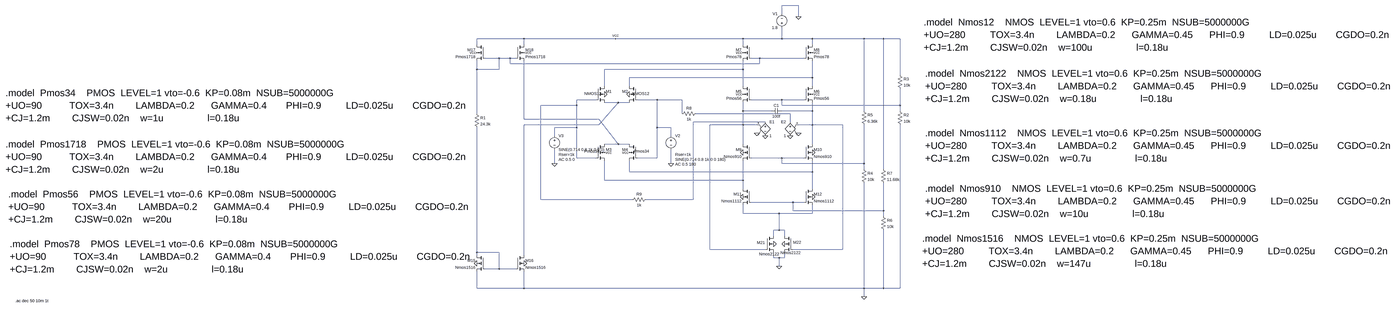
[diagram p0: schematic Project.asc, whole sheet]
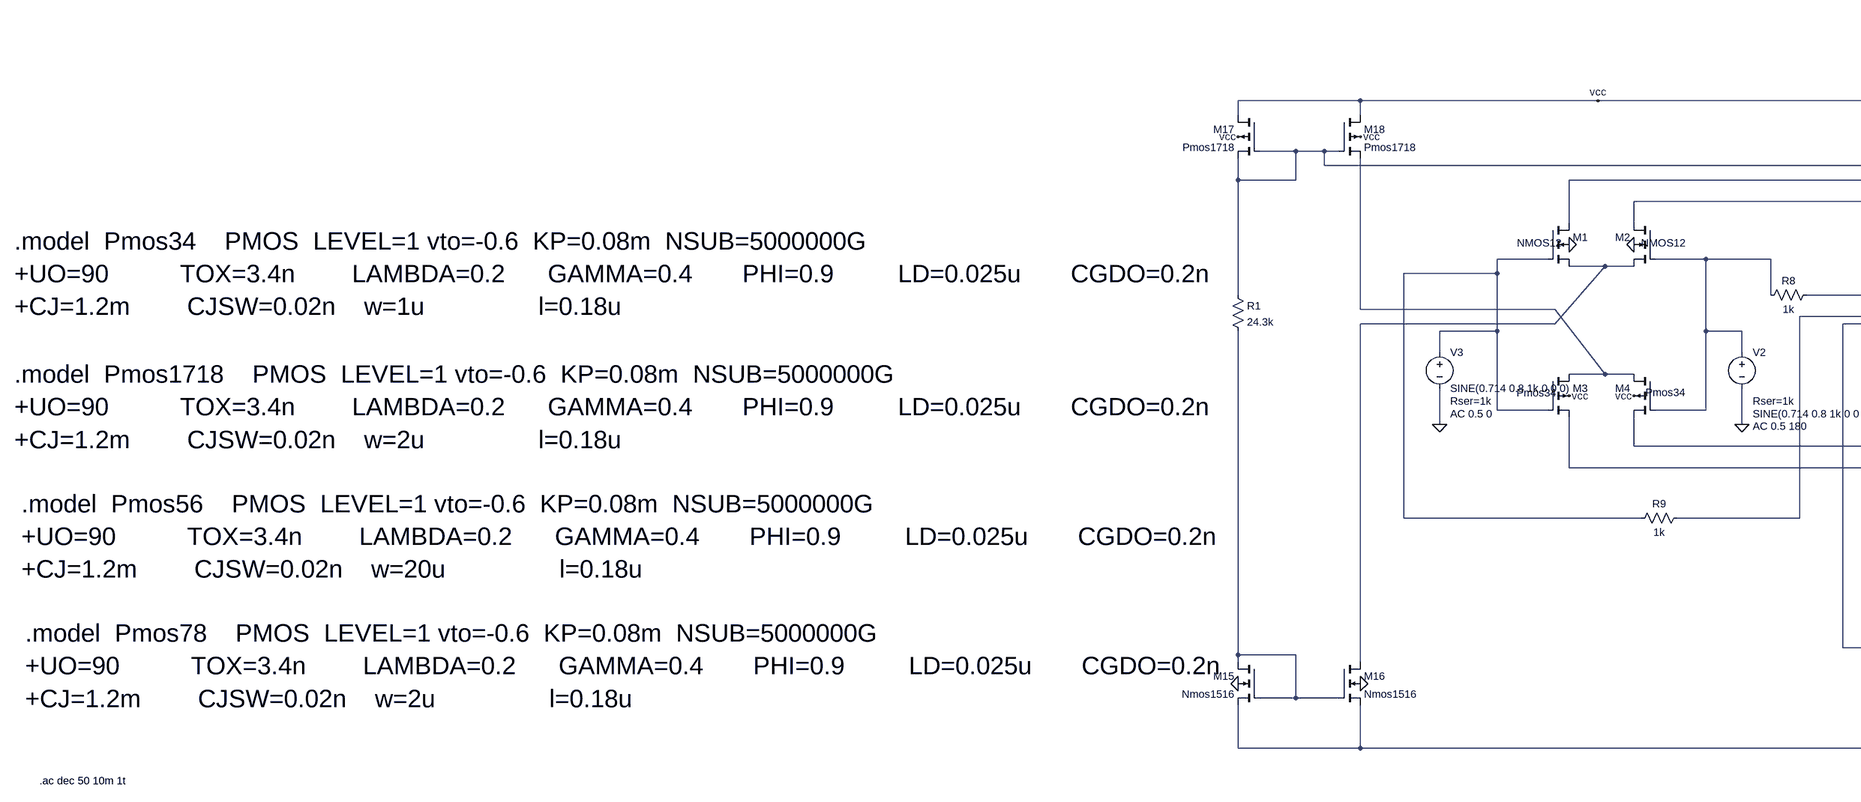
[diagram p1: schematic Project.asc, part, row 1 of 1, column 1 of 2]
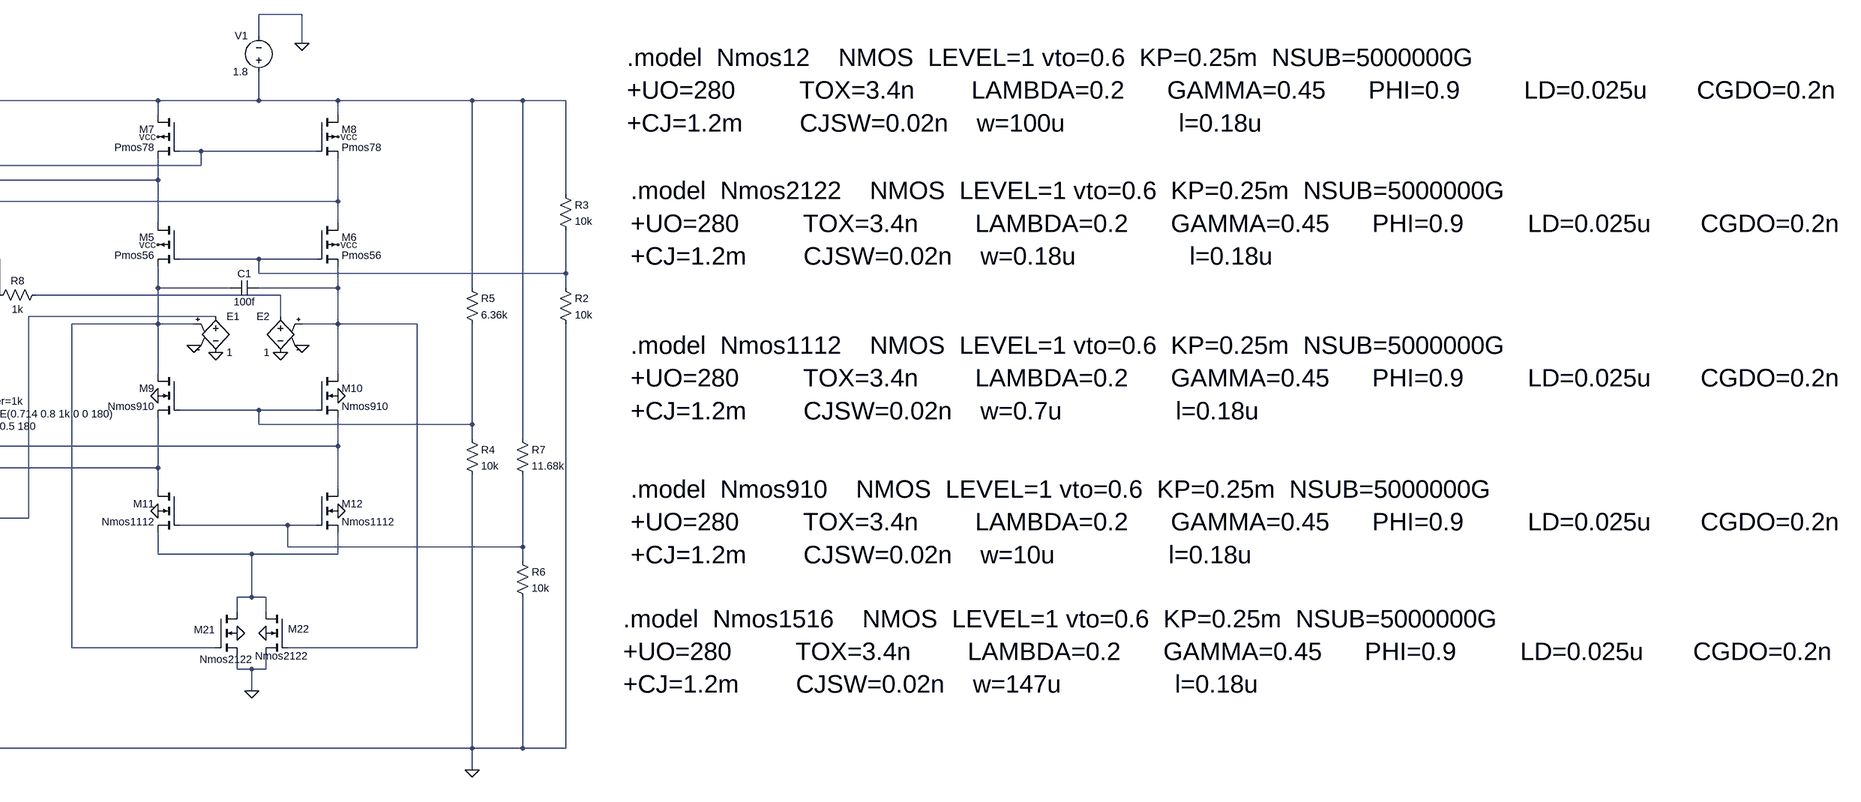
[diagram p2: schematic Project.asc, part, row 1 of 1, column 2 of 2]
Project.asc, the LTspice schematic file:
Version 4
SHEET 1 4820 1540
WIRE 1072 -528 976 -528
WIRE 976 -480 976 -528
WIRE 1072 -464 1072 -528
WIRE -512 -336 -784 -336
WIRE 16 -336 -512 -336
WIRE 752 -336 16 -336
WIRE 976 -336 976 -400
WIRE 976 -336 752 -336
WIRE 1152 -336 976 -336
WIRE 1552 -336 1152 -336
WIRE 1664 -336 1552 -336
WIRE 1760 -336 1664 -336
WIRE -784 -304 -784 -336
WIRE -512 -304 -512 -336
WIRE 752 -304 752 -336
WIRE 1152 -304 1152 -336
WIRE -656 -224 -736 -224
WIRE -592 -224 -656 -224
WIRE -560 -224 -592 -224
WIRE 848 -224 800 -224
WIRE 1104 -224 848 -224
WIRE -592 -192 -592 -224
WIRE 848 -192 848 -224
WIRE 848 -192 -592 -192
WIRE -784 -160 -784 -208
WIRE -656 -160 -656 -224
WIRE -656 -160 -784 -160
WIRE 752 -160 752 -208
WIRE 752 -160 -48 -160
WIRE 1760 -128 1760 -336
WIRE 1152 -112 1152 -208
WIRE 1152 -112 96 -112
WIRE -48 -64 -48 -160
WIRE 96 -64 96 -112
WIRE 752 -64 752 -160
WIRE 1152 -64 1152 -112
WIRE -96 16 -208 16
WIRE 256 16 144 16
WIRE 400 16 256 16
WIRE 976 16 800 16
WIRE 1104 16 976 16
WIRE 32 32 -48 32
WIRE 96 32 32 32
WIRE -208 48 -208 16
WIRE -208 48 -416 48
WIRE 976 48 976 16
WIRE 1760 48 1760 -48
WIRE 1760 48 976 48
WIRE 752 80 752 32
WIRE 912 80 752 80
WIRE 1152 80 1152 32
WIRE 1152 80 976 80
WIRE 1552 80 1552 -336
WIRE 1760 80 1760 48
WIRE -784 96 -784 -160
WIRE 400 96 400 16
WIRE 1024 96 480 96
WIRE -512 128 -512 -208
WIRE -80 128 -512 128
WIRE 880 144 464 144
WIRE 1024 144 1024 96
WIRE -80 160 32 32
WIRE -80 160 -512 160
WIRE 752 160 752 80
WIRE 752 160 560 160
WIRE 832 160 752 160
WIRE 1152 160 1152 80
WIRE 1152 160 1072 160
WIRE 1328 160 1152 160
WIRE -208 176 -208 48
WIRE -208 176 -336 176
WIRE 256 176 256 16
WIRE 336 176 256 176
WIRE -336 224 -336 176
WIRE 336 224 336 176
WIRE 32 272 -80 128
WIRE 32 272 -48 272
WIRE 96 272 32 272
WIRE 752 272 752 160
WIRE 1152 272 1152 160
WIRE -208 352 -208 176
WIRE -96 352 -208 352
WIRE 256 352 256 176
WIRE 256 352 144 352
WIRE 976 352 800 352
WIRE 1104 352 976 352
WIRE -336 384 -336 304
WIRE 336 384 336 304
WIRE 976 384 976 352
WIRE 1552 384 1552 160
WIRE 1552 384 976 384
WIRE 1552 416 1552 384
WIRE 1664 416 1664 -336
WIRE 96 432 96 368
WIRE 1152 432 1152 368
WIRE 1152 432 96 432
WIRE -48 480 -48 368
WIRE 752 480 752 368
WIRE 752 480 -48 480
WIRE 752 528 752 480
WIRE 1152 528 1152 432
WIRE -416 592 -416 48
WIRE 112 592 -416 592
WIRE 464 592 464 144
WIRE 464 592 192 592
WIRE 1040 608 800 608
WIRE 1104 608 1040 608
WIRE 1040 656 1040 608
WIRE 1664 656 1664 496
WIRE 1664 656 1040 656
WIRE 752 672 752 624
WIRE 960 672 752 672
WIRE 1152 672 1152 624
WIRE 1152 672 960 672
WIRE 1664 688 1664 656
WIRE 960 768 960 672
WIRE 960 768 928 768
WIRE 992 768 960 768
WIRE 928 800 928 768
WIRE 992 800 992 768
WIRE 560 880 560 160
WIRE 880 880 560 880
WIRE 1328 880 1328 160
WIRE 1328 880 1040 880
WIRE -784 896 -784 176
WIRE -656 896 -784 896
WIRE -784 912 -784 896
WIRE -512 912 -512 160
WIRE 928 928 928 896
WIRE 960 928 928 928
WIRE 992 928 992 896
WIRE 992 928 960 928
WIRE 960 976 960 928
WIRE -656 992 -656 896
WIRE -656 992 -736 992
WIRE -560 992 -656 992
WIRE -784 1104 -784 1008
WIRE -512 1104 -512 1008
WIRE -512 1104 -784 1104
WIRE 1552 1104 1552 496
WIRE 1552 1104 -512 1104
WIRE 1664 1104 1664 768
WIRE 1664 1104 1552 1104
WIRE 1760 1104 1760 160
WIRE 1760 1104 1664 1104
WIRE 1552 1152 1552 1104
FLAG 1072 -464 0
FLAG -336 384 0
FLAG 336 384 0
FLAG 1552 1152 0
FLAG 960 976 0
FLAG 16 -336 vcc
FLAG -512 -256 vcc
FLAG -784 -256 vcc
FLAG -48 320 vcc
FLAG 96 320 vcc
FLAG 1152 -256 vcc
FLAG 1152 -16 vcc
FLAG 752 -16 vcc
FLAG 752 -256 vcc
FLAG -48 -16 0
FLAG 96 -16 0
FLAG 752 320 0
FLAG 1152 320 0
FLAG 1152 576 0
FLAG 752 576 0
FLAG 928 848 0
FLAG 992 848 0
FLAG -784 960 0
FLAG -512 960 0
FLAG 880 224 0
FLAG 1024 224 0
FLAG 1072 208 0
FLAG 832 208 0
SYMBOL nmos4 -96 -64 R0
WINDOW 3 -68 44 Left 2
SYMATTR Value NMOS12
SYMATTR InstName M1
SYMBOL nmos4 144 -64 M0
WINDOW 3 -67 44 Left 2
SYMATTR Value NMOS12
SYMATTR InstName M2
SYMBOL pmos4 -96 272 R0
WINDOW 3 -69 42 Left 2
SYMATTR Value Pmos34
SYMATTR InstName M3
SYMBOL pmos4 144 272 M0
WINDOW 3 -66 41 Left 2
SYMATTR Value Pmos34
SYMATTR InstName M4
SYMBOL pmos4 800 -64 M0
SYMATTR InstName M5
SYMATTR Value Pmos56
SYMBOL pmos4 1104 -64 R0
SYMATTR InstName M6
SYMATTR Value Pmos56
SYMBOL pmos4 800 -304 M0
SYMATTR InstName M7
SYMATTR Value Pmos78
SYMBOL pmos4 1104 -304 R0
SYMATTR InstName M8
SYMATTR Value Pmos78
SYMBOL nmos4 800 272 M0
SYMATTR InstName M9
SYMATTR Value Nmos910
SYMBOL nmos4 1104 272 R0
SYMATTR InstName M10
SYMATTR Value Nmos910
SYMBOL nmos4 800 528 M0
SYMATTR InstName M11
SYMATTR Value Nmos1112
SYMBOL nmos4 1104 528 R0
SYMATTR InstName M12
SYMATTR Value Nmos1112
SYMBOL voltage 976 -384 R180
WINDOW 0 24 96 Left 2
WINDOW 3 24 16 Left 2
WINDOW 123 0 0 Left 0
WINDOW 39 0 0 Left 0
SYMATTR InstName V1
SYMATTR Value 1.8
SYMBOL voltage 336 208 R0
WINDOW 3 24 152 Left 2
WINDOW 123 24 180 Left 2
WINDOW 39 24 124 Left 2
SYMATTR Value SINE(0.714 0.8 1k 0 0 180)
SYMATTR Value2 AC 0.5 180
SYMATTR SpiceLine Rser=1k
SYMATTR InstName V2
SYMBOL voltage -336 208 R0
WINDOW 123 24 152 Left 2
WINDOW 39 24 124 Left 2
SYMATTR Value2 AC 0.5 0
SYMATTR SpiceLine Rser=1k
SYMATTR InstName V3
SYMATTR Value SINE(0.714 0.8 1k 0 0 0)
SYMBOL nmos4 -736 912 M0
SYMATTR InstName M15
SYMATTR Value Nmos1516
SYMBOL nmos4 -560 912 R0
SYMATTR InstName M16
SYMATTR Value Nmos1516
SYMBOL pmos4 -736 -304 M0
SYMATTR InstName M17
SYMATTR Value Pmos1718
SYMBOL pmos4 -560 -304 R0
SYMATTR InstName M18
SYMATTR Value Pmos1718
SYMBOL res -800 80 R0
SYMATTR InstName R1
SYMATTR Value 24.3k
SYMBOL res 1744 64 R0
SYMATTR InstName R2
SYMATTR Value 10k
SYMBOL res 1744 -144 R0
SYMATTR InstName R3
SYMATTR Value 10k
SYMBOL res 1536 400 R0
SYMATTR InstName R4
SYMATTR Value 10k
SYMBOL res 1536 64 R0
SYMATTR InstName R5
SYMATTR Value 6.36k
SYMBOL nmos4 880 800 R0
WINDOW 0 -48 40 Left 2
WINDOW 3 -36 106 Left 2
SYMATTR InstName M21
SYMATTR Value Nmos2122
SYMBOL nmos4 1040 800 M0
WINDOW 0 -48 39 Left 2
WINDOW 3 -45 99 Left 2
SYMATTR InstName M22
SYMATTR Value Nmos2122
SYMBOL res 1648 672 R0
SYMATTR InstName R6
SYMATTR Value 10k
SYMBOL res 1648 400 R0
SYMATTR InstName R7
SYMATTR Value 11.68k
SYMBOL res 384 112 R270
WINDOW 0 32 56 VTop 2
WINDOW 3 0 56 VBottom 2
SYMATTR InstName R8
SYMATTR Value 1k
SYMBOL res 208 576 R90
WINDOW 0 0 56 VBottom 2
WINDOW 3 32 56 VTop 2
SYMATTR InstName R9
SYMATTR Value 1k
SYMBOL e 880 128 R0
SYMATTR InstName E1
SYMATTR Value 1
SYMBOL e 1024 128 M0
SYMATTR InstName E2
SYMATTR Value 1
SYMBOL cap 976 64 R90
WINDOW 0 0 32 VBottom 2
WINDOW 3 32 32 VTop 2
SYMATTR InstName C1
SYMATTR Value 100f
TEXT 1896 -432 Left 5 !.model  Nmos12    NMOS  LEVEL=1 vto=0.6  KP=0.25m  NSUB=5000000G\n+UO=280         TOX=3.4n        LAMBDA=0.2      GAMMA=0.45      PHI=0.9         LD=0.025u       CGDO=0.2n\n+CJ=1.2m        CJSW=0.02n    w=100u                l=0.18u
TEXT -3504 -24 Left 5 !.model  Pmos34    PMOS  LEVEL=1 vto=-0.6  KP=0.08m  NSUB=5000000G\n+UO=90          TOX=3.4n        LAMBDA=0.2      GAMMA=0.4       PHI=0.9         LD=0.025u       CGDO=0.2n\n+CJ=1.2m        CJSW=0.02n    w=1u                l=0.18u
TEXT 1904 -136 Left 5 !.model  Nmos2122    NMOS  LEVEL=1 vto=0.6  KP=0.25m  NSUB=5000000G\n+UO=280         TOX=3.4n        LAMBDA=0.2      GAMMA=0.45      PHI=0.9         LD=0.025u       CGDO=0.2n\n+CJ=1.2m        CJSW=0.02n    w=0.18u                l=0.18u
TEXT 1904 208 Left 5 !.model  Nmos1112    NMOS  LEVEL=1 vto=0.6  KP=0.25m  NSUB=5000000G\n+UO=280         TOX=3.4n        LAMBDA=0.2      GAMMA=0.45      PHI=0.9         LD=0.025u       CGDO=0.2n\n+CJ=1.2m        CJSW=0.02n    w=0.7u                l=0.18u
TEXT 1904 528 Left 5 !.model  Nmos910    NMOS  LEVEL=1 vto=0.6  KP=0.25m  NSUB=5000000G\n+UO=280         TOX=3.4n        LAMBDA=0.2      GAMMA=0.45      PHI=0.9         LD=0.025u       CGDO=0.2n\n+CJ=1.2m        CJSW=0.02n    w=10u                l=0.18u
TEXT 1888 816 Left 5 !.model  Nmos1516    NMOS  LEVEL=1 vto=0.6  KP=0.25m  NSUB=5000000G\n+UO=280         TOX=3.4n        LAMBDA=0.2      GAMMA=0.45      PHI=0.9         LD=0.025u       CGDO=0.2n\n+CJ=1.2m        CJSW=0.02n    w=147u                l=0.18u
TEXT -3504 272 Left 5 !.model  Pmos1718    PMOS  LEVEL=1 vto=-0.6  KP=0.08m  NSUB=5000000G\n+UO=90          TOX=3.4n        LAMBDA=0.2      GAMMA=0.4       PHI=0.9         LD=0.025u       CGDO=0.2n\n+CJ=1.2m        CJSW=0.02n    w=2u                l=0.18u
TEXT -3488 560 Left 5 !.model  Pmos56    PMOS  LEVEL=1 vto=-0.6  KP=0.08m  NSUB=5000000G\n+UO=90          TOX=3.4n        LAMBDA=0.2      GAMMA=0.4       PHI=0.9         LD=0.025u       CGDO=0.2n\n+CJ=1.2m        CJSW=0.02n    w=20u                l=0.18u
TEXT -3480 848 Left 5 !.model  Pmos78    PMOS  LEVEL=1 vto=-0.6  KP=0.08m  NSUB=5000000G\n+UO=90          TOX=3.4n        LAMBDA=0.2      GAMMA=0.4       PHI=0.9         LD=0.025u       CGDO=0.2n\n+CJ=1.2m        CJSW=0.02n    w=2u                l=0.18u
TEXT -3448 1176 Left 2 !.ac dec 50 10m 1t

The netlist it stands for:
* Project.asc
M1 N002 N004 N007 0 NMOS12
M2 N003 N005 N007 0 NMOS12
M3 N011 N004 N015 vcc Pmos34
M4 N011 N005 N014 vcc Pmos34
M5 N002 N006 N008 vcc Pmos56
M6 N003 N006 N009 vcc Pmos56
M7 vcc N001 N002 vcc Pmos78
M8 vcc N001 N003 vcc Pmos78
M9 N008 N013 N015 0 Nmos910
M10 N009 N013 N014 0 Nmos910
M11 N015 N016 N017 0 Nmos1112
M12 N014 N016 N017 0 Nmos1112
V1 vcc 0 1.8
V2 N005 0 SINE(0.714 0.8 1k 0 0 180) AC 0.5 180 Rser=1k
V3 N004 0 SINE(0.714 0.8 1k 0 0 0) AC 0.5 0 Rser=1k
M15 N018 N018 0 0 Nmos1516
M16 N007 N018 0 0 Nmos1516
M17 vcc N001 N001 vcc Pmos1718
M18 vcc N001 N011 vcc Pmos1718
R1 N001 N018 24.3k
R2 N006 0 10k
R3 vcc N006 10k
R4 N013 0 10k
R5 vcc N013 6.36k
M21 N017 N008 0 0 Nmos2122
M22 N017 N009 0 0 Nmos2122
R6 N016 0 10k
R7 vcc N016 11.68k
R8 N005 N010 1k
R9 N012 N004 1k
E1 N012 0 N008 0 1
E2 N010 0 N009 0 1
C1 N009 N008 100f
.model NMOS NMOS
.model PMOS PMOS
.lib standard.mos
.model  Nmos12    NMOS  LEVEL=1 vto=0.6  KP=0.25m  NSUB=5000000G
+UO=280         TOX=3.4n        LAMBDA=0.2      GAMMA=0.45      PHI=0.9         LD=0.025u       CGDO=0.2n
+CJ=1.2m        CJSW=0.02n    w=100u                l=0.18u
.model  Pmos34    PMOS  LEVEL=1 vto=-0.6  KP=0.08m  NSUB=5000000G
+UO=90          TOX=3.4n        LAMBDA=0.2      GAMMA=0.4       PHI=0.9         LD=0.025u       CGDO=0.2n
+CJ=1.2m        CJSW=0.02n    w=1u                l=0.18u
.model  Nmos2122    NMOS  LEVEL=1 vto=0.6  KP=0.25m  NSUB=5000000G
+UO=280         TOX=3.4n        LAMBDA=0.2      GAMMA=0.45      PHI=0.9         LD=0.025u       CGDO=0.2n
+CJ=1.2m        CJSW=0.02n    w=0.18u                l=0.18u
.model  Nmos1112    NMOS  LEVEL=1 vto=0.6  KP=0.25m  NSUB=5000000G
+UO=280         TOX=3.4n        LAMBDA=0.2      GAMMA=0.45      PHI=0.9         LD=0.025u       CGDO=0.2n
+CJ=1.2m        CJSW=0.02n    w=0.7u                l=0.18u
.model  Nmos910    NMOS  LEVEL=1 vto=0.6  KP=0.25m  NSUB=5000000G
+UO=280         TOX=3.4n        LAMBDA=0.2      GAMMA=0.45      PHI=0.9         LD=0.025u       CGDO=0.2n
+CJ=1.2m        CJSW=0.02n    w=10u                l=0.18u
.model  Nmos1516    NMOS  LEVEL=1 vto=0.6  KP=0.25m  NSUB=5000000G
+UO=280         TOX=3.4n        LAMBDA=0.2      GAMMA=0.45      PHI=0.9         LD=0.025u       CGDO=0.2n
+CJ=1.2m        CJSW=0.02n    w=147u                l=0.18u
.model  Pmos1718    PMOS  LEVEL=1 vto=-0.6  KP=0.08m  NSUB=5000000G
+UO=90          TOX=3.4n        LAMBDA=0.2      GAMMA=0.4       PHI=0.9         LD=0.025u       CGDO=0.2n
+CJ=1.2m        CJSW=0.02n    w=2u                l=0.18u
.model  Pmos56    PMOS  LEVEL=1 vto=-0.6  KP=0.08m  NSUB=5000000G
+UO=90          TOX=3.4n        LAMBDA=0.2      GAMMA=0.4       PHI=0.9         LD=0.025u       CGDO=0.2n
+CJ=1.2m        CJSW=0.02n    w=20u                l=0.18u
.model  Pmos78    PMOS  LEVEL=1 vto=-0.6  KP=0.08m  NSUB=5000000G
+UO=90          TOX=3.4n        LAMBDA=0.2      GAMMA=0.4       PHI=0.9         LD=0.025u       CGDO=0.2n
+CJ=1.2m        CJSW=0.02n    w=2u                l=0.18u
.ac dec 50 10m 1t
.backanno
.end